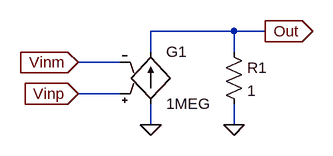
[diagram p0: schematic Ideal_op_amp.asc]
Ideal_op_amp.asc, the LTspice schematic file:
Version 4
SHEET 1 6300 692
WIRE 1600 240 1472 240
WIRE 1648 240 1600 240
WIRE 1472 272 1472 240
WIRE 1600 272 1600 240
WIRE 1424 288 1360 288
WIRE 1424 336 1360 336
WIRE 1472 384 1472 352
WIRE 1600 384 1600 352
FLAG 1472 384 0
FLAG 1648 240 Out
IOPIN 1648 240 Out
FLAG 1360 288 Vinm
IOPIN 1360 288 In
FLAG 1360 336 Vinp
IOPIN 1360 336 In
FLAG 1600 384 0
SYMBOL g2 1472 256 R0
SYMATTR InstName G1
SYMATTR Value 1MEG
SYMBOL res 1584 256 R0
SYMATTR InstName R1
SYMATTR Value 1

The netlist it stands for:
* Ideal_op_amp.asc
G1 0 Out Vinp Vinm 1MEG
R1 Out 0 1
.backanno
.end